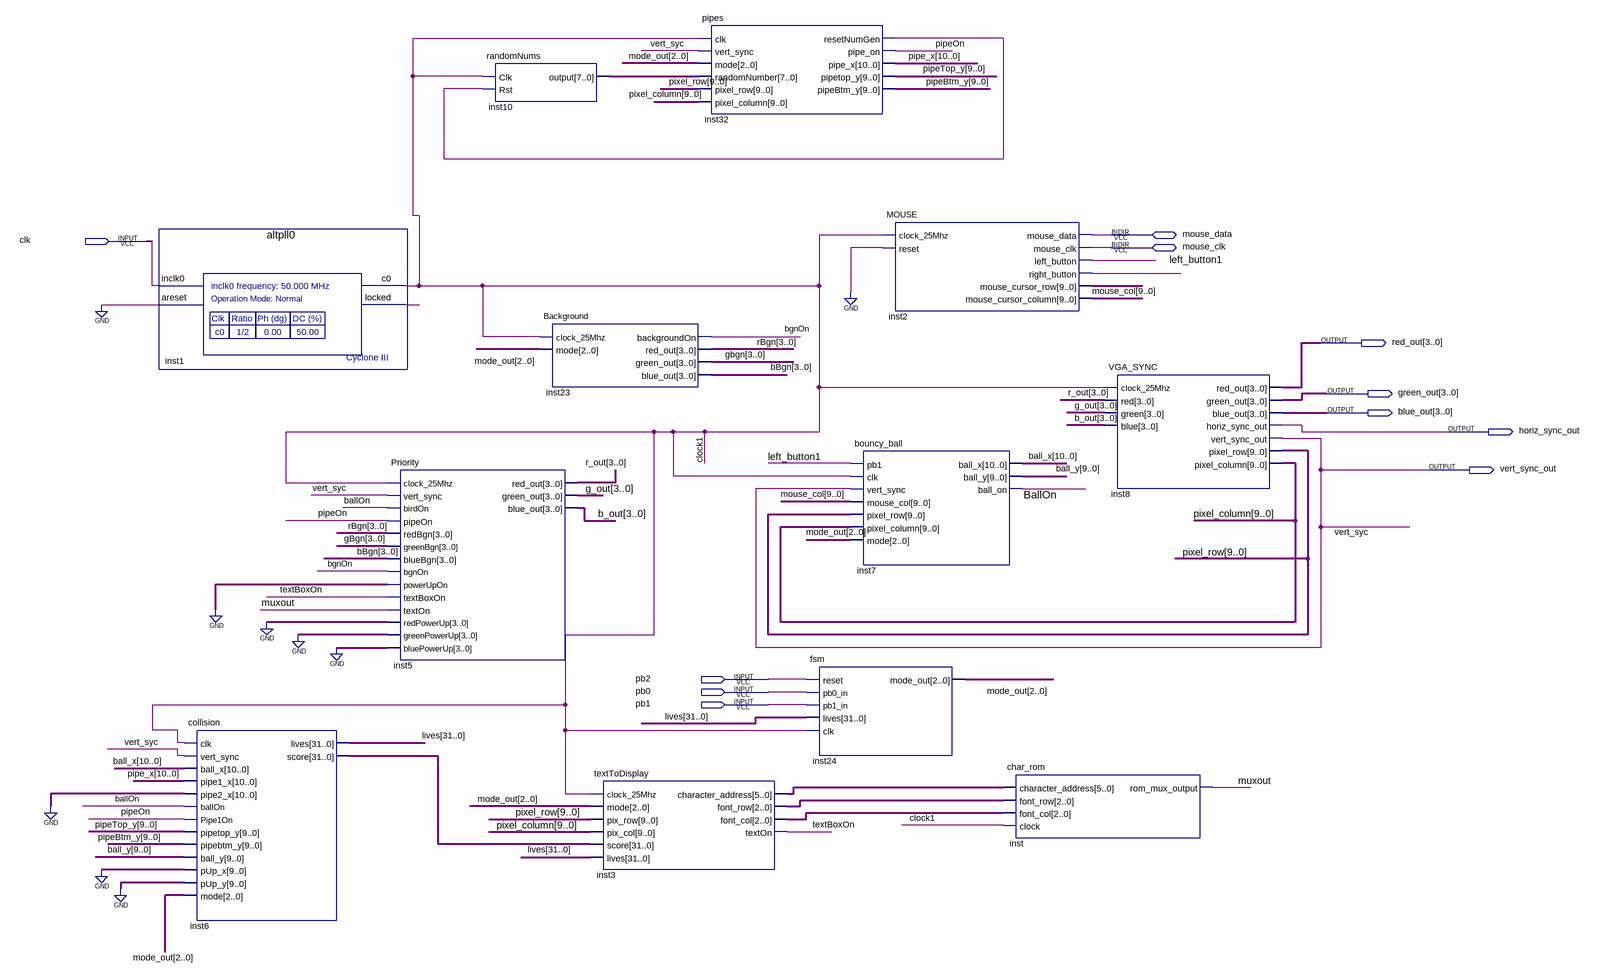
[diagram p0: schematic sheet]
// Quartus schematic flappyBirdFinal.bdf as structural Verilog: 12 symbols, 11 pins
module flappyBirdFinal (
  input  clk,
  input  pb2,
  input  pb0,
  input  pb1,
  inout  mouse_data,
  inout  mouse_clk,
  output [3:0] red_out,
  output [3:0] green_out,
  output [3:0] blue_out,
  output horiz_sync_out,
  output vert_sync_out
);

  wire ballOn, bgnOn, clock1, inst1_locked, inst2_right_button, inst32_resetnumgen, left_button1, muxout,
       pipeOn, textBoxOn;
  wire [2:0] inst3_font_col, inst3_font_row, mode_out;
  wire [3:0] b_out, bBgn, g_out, gBgn, r_out, rBgn;
  wire [5:0] inst3_character_address;
  wire [7:0] inst10_output;
  wire [9:0] ball_y, inst2_mouse_cursor_row, mouse_col, pipeBtm_y, pipeTop_y, pixel_column, pixel_row;
  wire [10:0] ball_x, pipe_x;
  wire [31:0] inst6_score, lives;

  altpll0 inst1 (.inclk0(clk), .areset(1'b0), .c0(clock1), .locked(inst1_locked));
  collision inst6 (
    .clk(clock1), .vert_sync(vert_sync_out), .ball_x(ball_x), .pipe1_x(pipe_x), .pipe2_x({11{1'b0}}),
    .ballOn(ballOn), .Pipe1On(pipeOn), .pipetop_y(pipeTop_y), .pipebtm_y(pipeBtm_y), .ball_y(ball_y),
    .pUp_x({10{1'b0}}), .pUp_y({10{1'b0}}), .mode(mode_out), .lives(lives), .score(inst6_score));
  Priority inst5 (
    .clock_25Mhz(clock1), .vert_sync(vert_sync_out), .birdOn(ballOn), .pipeOn(pipeOn), .redBgn(rBgn),
    .greenBgn(gBgn), .blueBgn(bBgn), .bgnOn(bgnOn), .powerUpOn(1'b0), .textBoxOn(textBoxOn), .textOn(muxout),
    .redPowerUp(4'b0000), .greenPowerUp(4'b0000), .bluePowerUp(4'b0000), .red_out(r_out), .green_out(g_out),
    .blue_out(b_out));
  randomNums inst10 (.Clk(clock1), .Rst(inst32_resetnumgen), .\output (inst10_output));
  Background inst23 (
    .clock_25Mhz(clock1), .mode(mode_out), .backgroundOn(bgnOn), .red_out(rBgn), .green_out(gBgn),
    .blue_out(bBgn));
  textToDisplay inst3 (
    .clock_25Mhz(clock1), .mode(mode_out), .pix_row(pixel_row), .pix_col(pixel_column), .score(inst6_score),
    .lives(lives), .character_address(inst3_character_address), .font_row(inst3_font_row),
    .font_col(inst3_font_col), .textOn(textBoxOn));
  pipes inst32 (
    .clk(clock1), .vert_sync(vert_sync_out), .mode(mode_out), .randomNumber(inst10_output),
    .pixel_row(pixel_row), .pixel_column(pixel_column), .resetNumGen(inst32_resetnumgen), .pipe_on(pipeOn),
    .pipe_x(pipe_x), .pipetop_y(pipeTop_y), .pipeBtm_y(pipeBtm_y));
  fsm inst24 (.reset(pb2), .pb0_in(pb0), .pb1_in(pb1), .lives(lives), .clk(clock1), .mode_out(mode_out));
  MOUSE inst2 (
    .clock_25Mhz(clock1), .reset(1'b0), .left_button(left_button1), .right_button(inst2_right_button),
    .mouse_cursor_row(inst2_mouse_cursor_row), .mouse_cursor_column(mouse_col), .mouse_data(mouse_data),
    .mouse_clk(mouse_clk));
  bouncy_ball inst7 (
    .pb1(left_button1), .clk(clock1), .vert_sync(vert_sync_out), .mouse_col(mouse_col),
    .pixel_row(pixel_row), .pixel_column(pixel_column), .mode(mode_out), .ball_x(ball_x), .ball_y(ball_y),
    .ball_on(ballOn));
  char_rom inst (
    .character_address(inst3_character_address), .font_row(inst3_font_row), .font_col(inst3_font_col),
    .clock(clock1), .rom_mux_output(muxout));
  VGA_SYNC inst8 (
    .clock_25Mhz(clock1), .red(r_out), .green(g_out), .blue(b_out), .red_out(red_out), .green_out(green_out),
    .blue_out(blue_out), .horiz_sync_out(horiz_sync_out), .vert_sync_out(vert_sync_out),
    .pixel_row(pixel_row), .pixel_column(pixel_column));

  // Other names for the same wires on the sheet: vert_syc = vert_sync_out
endmodule
